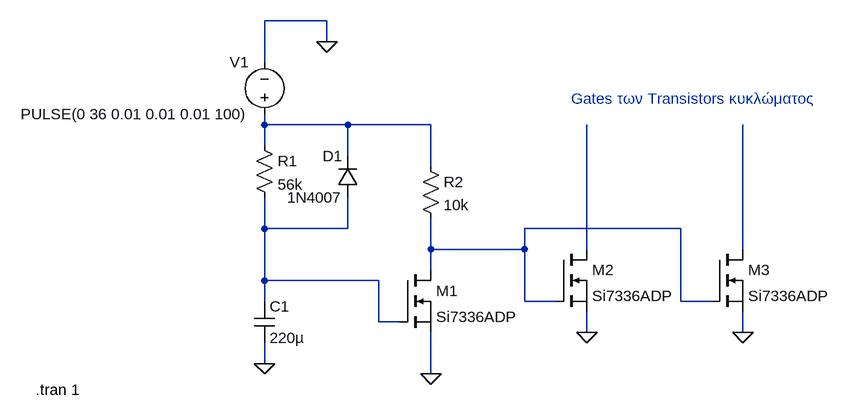
[diagram p0: schematic soft_start.asc]
soft_start.asc, the LTspice schematic file:
Version 4
SHEET 1 880 680
WIRE -160 -528 -256 -528
WIRE -160 -496 -160 -528
WIRE -256 -464 -256 -528
WIRE -256 -368 -256 -384
WIRE -128 -368 -256 -368
WIRE 0 -368 -128 -368
WIRE -256 -336 -256 -368
WIRE -128 -320 -128 -368
WIRE 0 -304 0 -368
WIRE -256 -208 -256 -256
WIRE -128 -208 -128 -256
WIRE -128 -208 -256 -208
WIRE 384 -208 144 -208
WIRE 0 -176 0 -224
WIRE 144 -176 144 -208
WIRE 144 -176 0 -176
WIRE 240 -176 240 -368
WIRE 480 -176 480 -368
WIRE 0 -144 0 -176
WIRE -256 -128 -256 -208
WIRE -80 -128 -256 -128
WIRE -256 -96 -256 -128
WIRE 144 -96 144 -176
WIRE 192 -96 144 -96
WIRE 384 -96 384 -208
WIRE 432 -96 384 -96
WIRE -80 -64 -80 -128
WIRE -48 -64 -80 -64
WIRE 240 -48 240 -80
WIRE 480 -48 480 -80
WIRE -256 0 -256 -32
WIRE 0 16 0 -48
FLAG -160 -496 0
FLAG -256 0 0
FLAG 0 16 0
FLAG 480 -48 0
FLAG 240 -48 0
SYMBOL voltage -256 -368 R180
WINDOW 0 24 96 Left 2
WINDOW 3 24 16 Left 2
WINDOW 123 0 0 Left 0
WINDOW 39 0 0 Left 0
SYMATTR InstName V1
SYMATTR Value PULSE(0 36 0.01 0.01 0.01 100)
SYMBOL res -272 -352 R0
SYMATTR InstName R1
SYMATTR Value 56k
SYMBOL diode -112 -256 R180
WINDOW 0 24 64 Left 2
WINDOW 3 24 0 Left 2
SYMATTR InstName D1
SYMATTR Value 1N4007
SYMBOL res -16 -320 R0
SYMATTR InstName R2
SYMATTR Value 10k
SYMBOL cap -272 -96 R0
SYMATTR InstName C1
SYMATTR Value 220µ
SYMBOL nmos -48 -144 R0
SYMATTR InstName M1
SYMATTR Value Si7336ADP
SYMBOL nmos 192 -176 R0
SYMATTR InstName M2
SYMATTR Value Si7336ADP
SYMBOL nmos 432 -176 R0
SYMATTR InstName M3
SYMATTR Value Si7336ADP
TEXT -608 40 Left 2 !.tran 1
TEXT 216 -408 Left 2 ;Gates των Transistors κυκλώματος

The netlist it stands for:
* soft_start.asc
V1 N001 0 PULSE(0 36 0.01 0.01 0.01 100)
R1 N001 N002 56k
D1 N002 N001 1N4007
R2 N001 N003 10k
C1 N002 0 220µ
M1 N003 N002 0 0 Si7336ADP
M2 N004 N003 0 0 Si7336ADP
M3 N005 N003 0 0 Si7336ADP
.model D D
.lib standard.dio
.model NMOS NMOS
.model PMOS PMOS
.lib standard.mos
.tran 1
* Gates των Transistors κυκλώματος
.backanno
.end